# Altium schematic sheet Sheet_brainstorm1.SchDoc: Hot and Cold Compression Device Circuit Design
size A; SheetNumber: 1; SheetTotal: 1
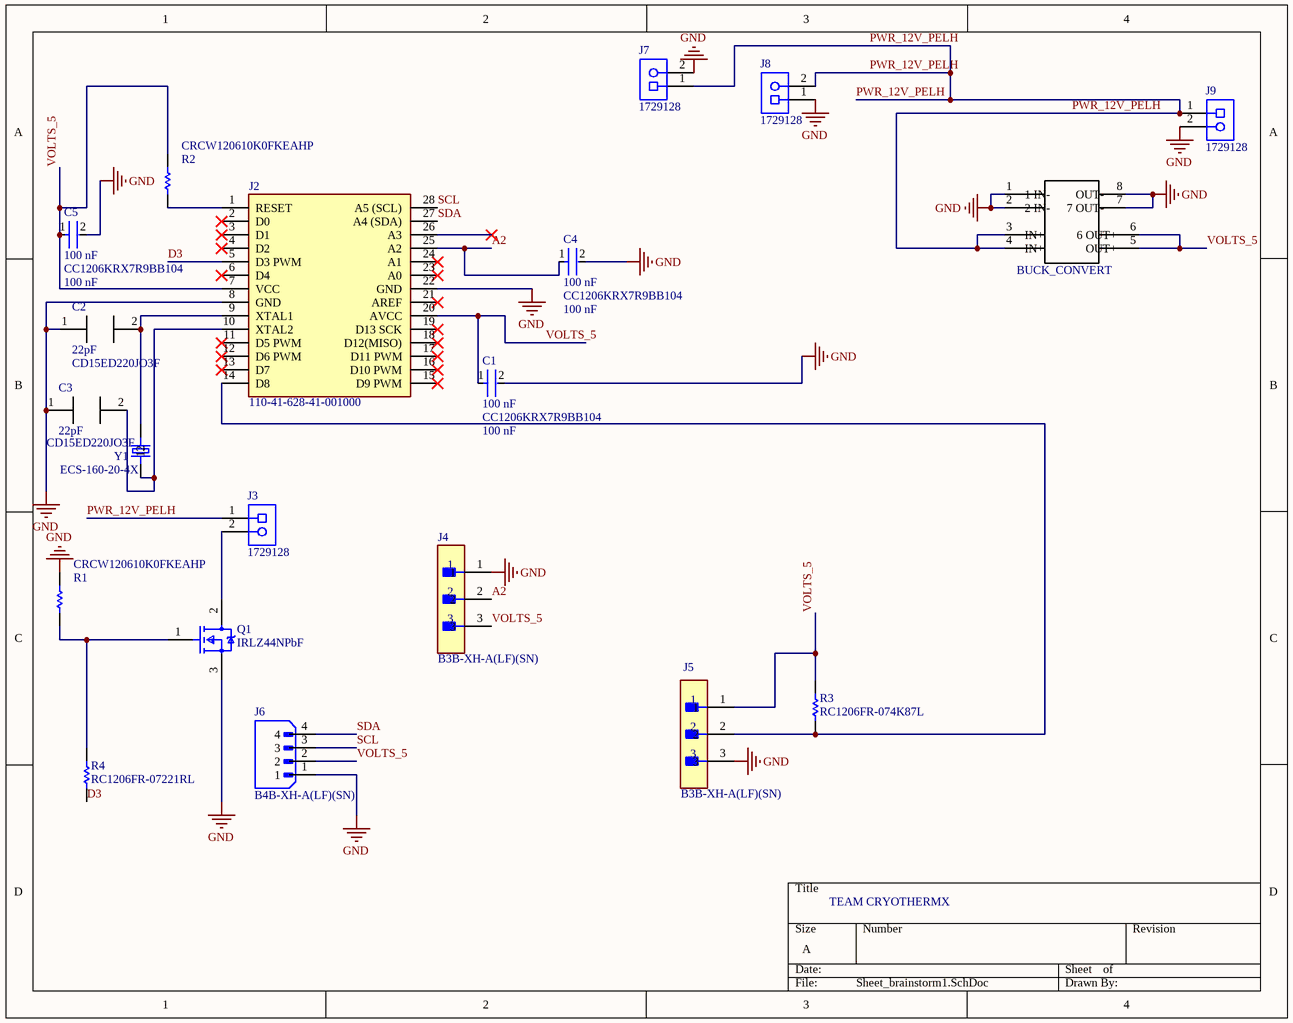
[diagram p0: Sheet_brainstorm1.SchDoc]

## Parts
BUCK_CONVERT  buck convertter  [BUCK_CONVERTER]  (value not drawn)
C1  100 nF  Manufacturer Part Number: CC1206KRX7R9BB104  [FP-CC1206-1_25-MFG]
C2  22pF  [PCBComponent_1]
C3  22pF  [PCBComponent_1]
C4  100 nF  Manufacturer Part Number: CC1206KRX7R9BB104  [FP-CC1206-1_25-MFG]
C5  100 nF  Manufacturer Part Number: CC1206KRX7R9BB104  [FP-CC1206-1_25-MFG]
J2  110-41-628-41-001000  [DIPS1524W50P254L3556H419Q28]
J3  1729128  [PHOE-1729128-2_V]
J4  B3B-XH-A(LF)(SN)  [FP-B3B-XH-A_LF_SN-MFG]
J5  B3B-XH-A(LF)(SN)  [FP-B3B-XH-A_LF_SN-MFG]
J6  B4B-XH-A(LF)(SN)  [JST_B4B-XH-A(LF)(SN)]
J7  1729128  [PHOE-1729128-2_V]
J8  1729128  [PHOE-1729128-2_V]
J9  1729128  [PHOE-1729128-2_V]
Q1  IRLZ44NPbF  [FP-PG-TO220-3-MFG]
R1  CRCW120610K0FKEAHP  [RESC3116X65X50NL20T20]
R2  CRCW120610K0FKEAHP  [RESC3116X65X50NL20T20]
R3  RC1206FR-074K87L  [RESC3116X65X40ML10T20]
R4  RC1206FR-07221RL  [RESC3116X65X40LL10T20]
Y1  ECS-160-20-4X  [XTAL_ECS-160-20-4X]

## Nets
GND: BUCK_CONVERT.1(1_IN-) BUCK_CONVERT.2(2_IN-) BUCK_CONVERT.7(7_OUT-) BUCK_CONVERT.8(OUT-) C1.2 C2.1 C3.1 C4.2 C5.2 J2.8(GND) J2.22(GND) J4.1 J5.3 J6.1 J7.2 J8.1 J9.2 Q1.3(S) R1.2
A2: C4.1 J2.25(A2) J4.2
D3: J2.5(D3_PWM) R4.1
PWR_12V_PELH: BUCK_CONVERT.3(IN+) BUCK_CONVERT.4(IN+) J3.1 J7.1 J8.2 J9.1
SCL: J2.28(A5_(SCL)) J6.3
SDA: J2.27(A4_(SDA)) J6.4
VOLTS_5: BUCK_CONVERT.5(OUT+) BUCK_CONVERT.6(6_OUT+) C1.1 C5.1 J2.7(VCC) J2.20(AVCC) J4.3 J5.1 J6.2 R2.2 R3.2
NetC2_2: C2.2 J2.9(XTAL1) Y1.2
NetC3_2: C3.2 J2.10(XTAL2) Y1.1
NetJ2_1: J2.1(RESET) R2.1
NetJ2_14: J2.14(D8) J5.2 R3.1
NetJ3_2: J3.2 Q1.2(D)
NetQ1_1: Q1.1(G) R1.1 R4.2

Not connected (* = marked no-connect by the designer): J2 2(D0)* 3(D1)* 4(D2)* 6(D4)* 11(D5_PWM)* 12(D6_PWM)* 13(D7)* 15(D9_PWM)* 16(D10_PWM)* 17(D11_PWM)* 18(D12(MISO))* 19(D13_SCK)* 21(AREF)* 23(A0)* 24(A1)* 26(A3)*

## Notes on the sheet
- TEAM CRYOTHERMX

## Library data of the parts
C1 C4 C5 = CMP-03422-000842-1: CAP CER 0.1UF 50V X7R 1206; Manufacturer: Yageo; Automotive Grade: NA; Tolerance: 0.1; Material: Ceramic; Temperature Coefficient: 15%; Temperature Characteristic: X7R; Device Class L1: Passive Components; Lead Free: Yes; Octopart: https://octopart.com/cc1206krx7r9bb104-yageo-39467816; Category: Cap; Value: 100 nF; Temperature Range Low: -55°C; Device Class L3: Ceramic Capacitors; Voltage Rating: 50 V; Temperature Range High: +125°C; Device Class L2: Capacitors; RoHS: TRUE; Package: CC1206-1.25; Footprint Url: http://www.yageo.com/exep/pages/download/literatures/UPY-C_GEN_24.pdf; ComponentLink2Description: Datasheet; Temperature: -55°C to +125°C; Capacitance: 100 nF; Digikey Description: CAP CER 0.1UF 50V X7R 1206; Height: 1.45mm; Automotive: No; Mouser Description: Multilayer Ceramic Capacitors MLCC - SMD/SMT 100nF 50V X7R 10%; ComponentLink2URL: http://www.yageo.com/documents/recent/UPY-NP0X7R_HV_1KV-to-3KV_11.pdf
C2 C3 = CD15ED220JO3F: Mica Capacitor, Mica, 500V, 5% +Tol, 5% -Tol, -20/+100ppm/Cel TC, 0.000022uF, Through Hole Mount; Manufacturer: Cornell Dubilier; Supplier: Digikey; Supplier Part Number: 338-2602-ND; RoHS: Yes; Category: Mica Capacitors; Stock: 1576; Pricing: 1=3.21, 10=2.244, 50=1.861, 100=1.7425, 500=1.54216, 1000=1.4801, 2500=1.41456, 5000=1.37502 (USD); Mounting Technology: Through Hole; Pins: 2; Dielectric Material: Mica; Package Shape: Rectangular; Case/Package: 4517; Terminal Finish: Nickel; Min Operating Temperature: -55°C; Max Operating Temperature: 125°C; JESD-609 Code: e3; Capacitor Type: Mica; Tolerance  (fill in as +-): 5%; Package Style: RadialMeter; Packaging: Tape and Reel; Tolerance (fill in as +-): 5%; Rated DC Voltage (URdc): 500V; Termination: Wire; Length: 11.4mm; Width: 4.3mm; Height: 9.1mm; Terminal Pitch: 5.9mm; Reach SVHC Compliant: Yes; RoHS Compliant: Yes; ComponentLink1URL: https://datasheet.ciiva.com:443/pdfs/VipMasterIC/IC/CDUB/CDUB-S-A0009903856/CDUB-S-A0009903856-1.pdf?src-supplier=IHS+Markit; ComponentLink1Description: https://datasheet.ciiva.com:443/pdfs/VipMasterIC/IC/CDUB/CDUB-S-A0009903856/CDUB-S-A0009903856-1.pdf?src-supplier=IHS+Markit; ComponentLink2URL: https://datasheet.ciiva.com/254/cd10-254791.pdf?src-supplier=Digikey; ComponentLink2Description: https://datasheet.ciiva.com/254/cd10-254791.pdf?src-supplier=Digikey; ComponentLink3URL: https://datasheet.ciiva.com/15914/407std-dipped-15914297.pdf?src-supplier=Onlinecomponents.com; ComponentLink3Description: https://datasheet.ciiva.com/15914/407std-dipped-15914297.pdf?src-supplier=Onlinecomponents.com; ComponentLink4URL: https://datasheet.ciiva.com/1459/87234-1459678.pdf?src-supplier=Element14; ComponentLink4Description: https://datasheet.ciiva.com/1459/87234-1459678.pdf?src-supplier=Element14; ComponentLink5URL: https://datasheet.ciiva.com/14591/70189459-14591579.pdf?src-supplier=Allied+Electronics; ComponentLink5Description: https://datasheet.ciiva.com/14591/70189459-14591579.pdf?src-supplier=Allied+Electronics; ComponentLink6URL: https://datasheet.ciiva.com/16294/std-dipped-16294766.pdf?src-supplier=Future+Electronics; ComponentLink6Description: https://datasheet.ciiva.com/16294/std-dipped-16294766.pdf?src-supplier=Future+Electronics; ComponentLink7URL: https://datasheet.ciiva.com/15164/getdatasheetpartid-61690-15164378.pdf?src-supplier=Verical; ComponentLink7Description: https://datasheet.ciiva.com/15164/getdatasheetpartid-61690-15164378.pdf?src-supplier=Verical; Manufacturer Part Number: CD15ED220JO3F; Value: 22pF
J2 = 110-41-628-41-001000: 28 (2 x 14) Pos DIP, 0.6 (15.24mm) Row Spacing Socket Gold Through Hole; MF: Mill-Max; Value: *; Package: None; Purchase-URL: https://pricing.snapeda.com/search/part/110-41-628-41-001000/?ref=eda; SnapEDA_Link: https://www.snapeda.com/parts/110-41-628-41-001000/Mill-Max%20Manufacturing%20Corp./view-part/1297615/?ref=snap; Price: None; Check_prices: https://www.snapeda.com/parts/110-41-628-41-001000/Mill-Max%20Manufacturing%20Corp./view-part/1297615/?ref=eda; Availability: Good; MP: 110-41-628-41-001000
J3 J7-J9 = CMP-2000-05815-1: PCB Terminal Block, 13.5 A, 400 V, 2-Pin THD, RoHS, Bulk; Manufacturer: Phoenix Contact; Package Version: 03/2015; No. of Rows: 1; Pitch: 5.08mm; No. of Positions: 2; Voltage Rating: 400V; Current Rating: 13500mA; Manufacturer URL: http://www.phoenixcontact.com/; Datasheet URL: https://datasheet.ciiva.com/16046/1729128-16046181.pdf; RoHS: TRUE; Package URL: https://www.phoenixcontact.com/online/portal/pi/pxc/product_detail_page/!ut/p/b1/3VdJjqNKFDxLH8AFycySyWY2ozFsEPOMMQaDOX1XedGL_1Vdm5YXJleknhSKeBkvI6EA8ncAo3AYoDhBQGco6KN7VURTdemj9us_IEKEZo_YHiPAEWEFmDGOHMORkqKYCORBZxgL7ZoaZYcbFFUZ3fqxSY6GOuxydWUuHqz1ynmMFygu583Bob0Ewr6Sd_l-5m-kAueHiB0jpRwZwe58wwtkpxtMYd_LmGcDRU02dRNEyWt6Y2ti5pSyJ_reIkzIulrqApdnbT11V5jnCKbYNCvhEM1MCpPByat_X379-iThf08CI5GfOPqfBeS3BRoBOdD55AKVv0iLwCMq-2BrzXWSGRH7pUGD9uwXQjiph3xL0DKQwdGa0JImiIOmBNOestqgwTHSSs2oOep-78apyXQBvNi8ZLaFjvjWvcaUEBu0MC6Wbe-d6mB0FAebo2lUWinqYaZs5DAYzV0RP9yitUjnGJ0iI9xhZkT42OCQNUJJhkgWINNQLP2JFP6OpMg3JCVg70jqHT0lvKOnhHf0lPuOnnLf0VPuWx6_dxwUIvwk5WMkT0kLL1mh61l2yZVSzG3pYV_bqo-mj6uMKwKwdnnW8Jh5RTOJzMOA5c-eJDaZQw4mTMPH02PvS_ZAqNVjVTo2WyYLkwH_KU1mmmG5kjRhDqPXLwwVHvVOjCM60-fpXvTDfMGW1PVFVS1r4e4yVDk4ZdNbkUHvqPqQSeian4UD39fNKmachqdJ1NJbyk8rXT9mXTvPk3oE5meulKGgiruPJek-4I9hTT6G8ZLOyRSm2RRVbThERQad5OS28hdt4YW4vG0stgYYzsWsK4_7y6DZMjJSCqri1kyiZR5vD7pwIrNR7QwPHTcLTI5qT7eRlpHrdGiupYlqQDJ7zy_CND8fWWBoLRXxk1RVcXiBQwbTD4Xi7KL-FuO94t9xaqweXzH; PartNumber: 1729128; Package Description: 2-Pin Through Hole Device, Body 8.1 x 10.16 mm, Pitch 5.08 mm; Datasheet Version: 12/2013; Mounting Technology: ThroughHole; Orientation: Horizontal; Package Reference: 1729128-2; Packing: Bulk
J4 J5 = CMP-17439-000014-3: CONN HEADER VERT 3POS 2.5MM; Max Voltage Rating (DC): 250V; Number of Positions: 3; Current Rating: 3A; Gender: Male; Wire/Cable Gauge: 22AWG; Contact Resistance: 20mR; Insulation Resistance: 1GR; Insulation Material: Nylon; Contact Plating: Tin; Depth: 5.75mm; Contact Type: Male Pin; Max Operating Temperature: 85°C; Insulation Color: Natural; Voltage Rating (AC): 250V; Color: Natural; Connector Type: Header; Orientation: Straight; Fastening Type: Detent; Housing Color: White; Min Operating Temperature: -25°C; Termination: Solder; Voltage Rating: 250V; Series: XH; Pitch: 2.5mm; Contact Shape: Square; Number of Rows: 1; Lead Free: Lead Free; Packaging: Bulk; Mount: Through Hole; Flammability Rating: UL94 V-0; Max Voltage Rating (AC): 250V; REACH SVHC: No SVHC; Housing Material: Polyamide; Contact Material: Brass; Lead Pitch: 2.5mm; Contact Finish - Mating: TIN; Length: 9.9mm; Max Current Rating: 3A; Number of Contacts: 3
J6 = B4B-XH-A(LF)(SN): Connector Header Through Hole 4 position 0.098 (2.50mm); MF: JST Sales; SnapEDA_Link: https://www.snapeda.com/parts/B4B-XH-A(LF)(SN)/JST+Sales+America+Inc./view-part/?ref=snap; Package: None; Value: *; MP: B4B-XH-A(LF)(SN); Check_prices: https://www.snapeda.com/parts/B4B-XH-A(LF)(SN)/JST+Sales+America+Inc./view-part/?ref=eda
Q1 = CMP-32901-000488-1: MOSFET N-CH 55V 47A TO220AB; Turn-On Delay Time: 11ns; Gate to Source Voltage (Vgs): 16V; Element Configuration: Single; Rds On Max: 22mR; Turn-Off Delay Time: 26ns; Max Power Dissipation: 110W; Threshold Voltage: 2V; Drain to Source Resistance: 35mR; Input Capacitance: 1.7nF; Continuous Drain Current (ID): 47A; Case/Package: TO-220; Lead Free: Lead Free; Halogen Free: Halogen Free; Packaging: Rail/Tube; Length: 0.414inch; Min Operating Temperature: -55°C; REACH SVHC: No SVHC; Number of Pins: 3; Width: 0.185inch; Drain to Source Voltage (Vdss): 55V; Power Dissipation: 110W; RoHS Compliant: Yes; Max Operating Temperature: 175°C; Height: 0.6inch; Max Dual Supply Voltage: 55V; Drain to Source Breakdown Voltage: 55V; Mount: Through Hole
R1 R2 = CMP-2003-04883-1: 10KOhm R -CRCW120610K0FKEAHP; Manufacturer: Vishay Dale; Part Number: CRCW120610K0FKEAHP
R3 = CMP-2003-03785-1: Manufacturer: Yageo; Part Number: RC1206FR-074K87L
R4 = CMP-2003-03622-1: Manufacturer: Yageo; Part Number: RC1206FR-07221RL
Y1 = ECS-160-20-4X: 16 MHz Â±30ppm Crystal 20pF 40 Ohms HC-49/US; MF: ECS Inc.; SnapEDA_Link: https://www.snapeda.com/parts/ECS-160-20-4X/ECS/view-part/?ref=snap; Package: HC-49USX-4X-2 ECS; Value: *; MP: ECS-160-20-4X; Check_prices: https://www.snapeda.com/parts/ECS-160-20-4X/ECS/view-part/?ref=eda